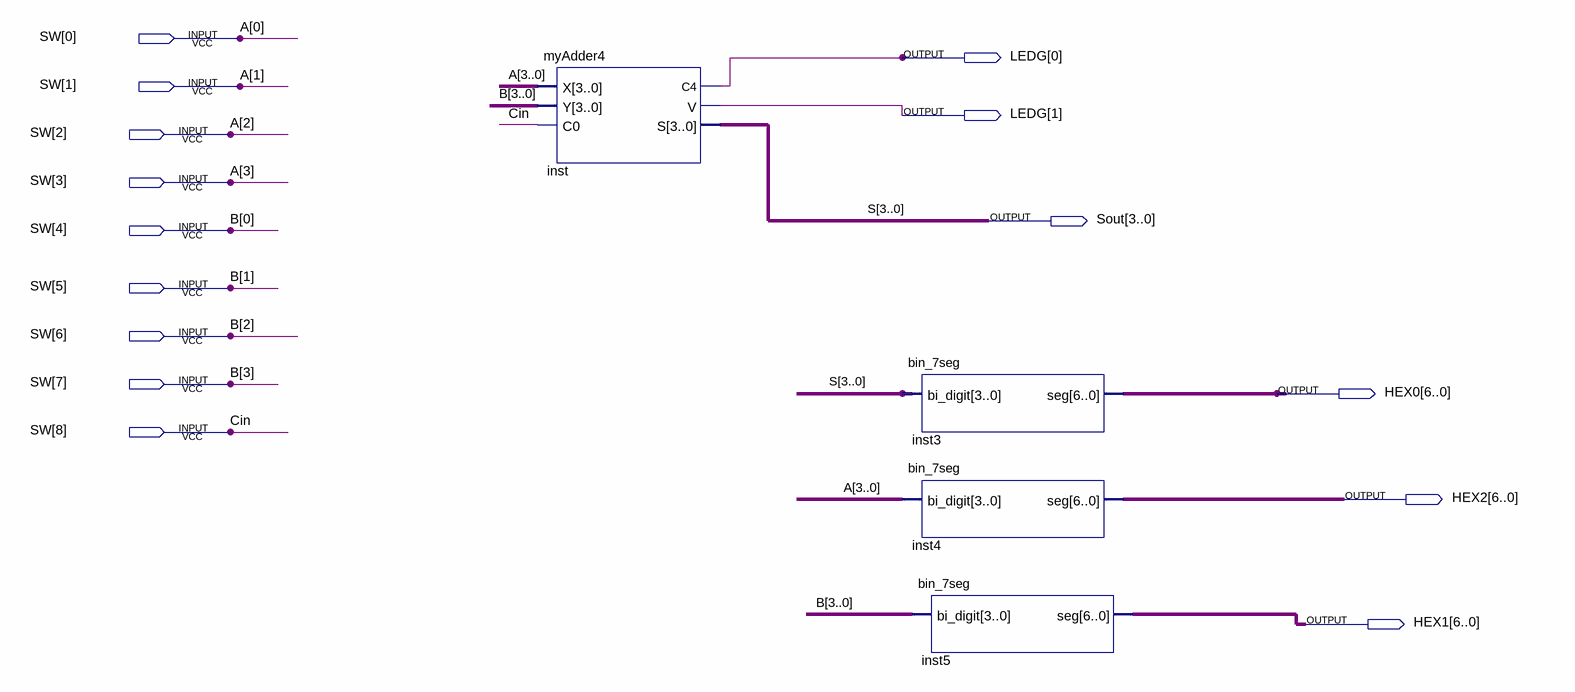
[diagram p0: schematic sheet]
// Quartus schematic Lab5.bdf as structural Verilog: 4 symbols, 15 pins
module Lab5 (
  input  [8:0] SW,
  output [1:0] LEDG,
  output [3:0] Sout,
  output [6:0] HEX0,
  output [6:0] HEX2,
  output [6:0] HEX1
);

  myAdder4 inst (.X(SW[3:0]), .Y(SW[7:4]), .C0(SW[8]), .C4(LEDG[0]), .V(LEDG[1]), .S(Sout));
  bin_7seg inst3 (.bi_digit(Sout), .seg(HEX0));
  bin_7seg inst4 (.bi_digit(SW[3:0]), .seg(HEX2));
  bin_7seg inst5 (.bi_digit(SW[7:4]), .seg(HEX1));

  // Other names for the same wires on the sheet: S[3:0] = Sout; A[3:0] = SW[3:0]; B[3:0] = SW[7:4]; Cin = SW[8]
endmodule
